# Altium project ADS1294.PrjPcb
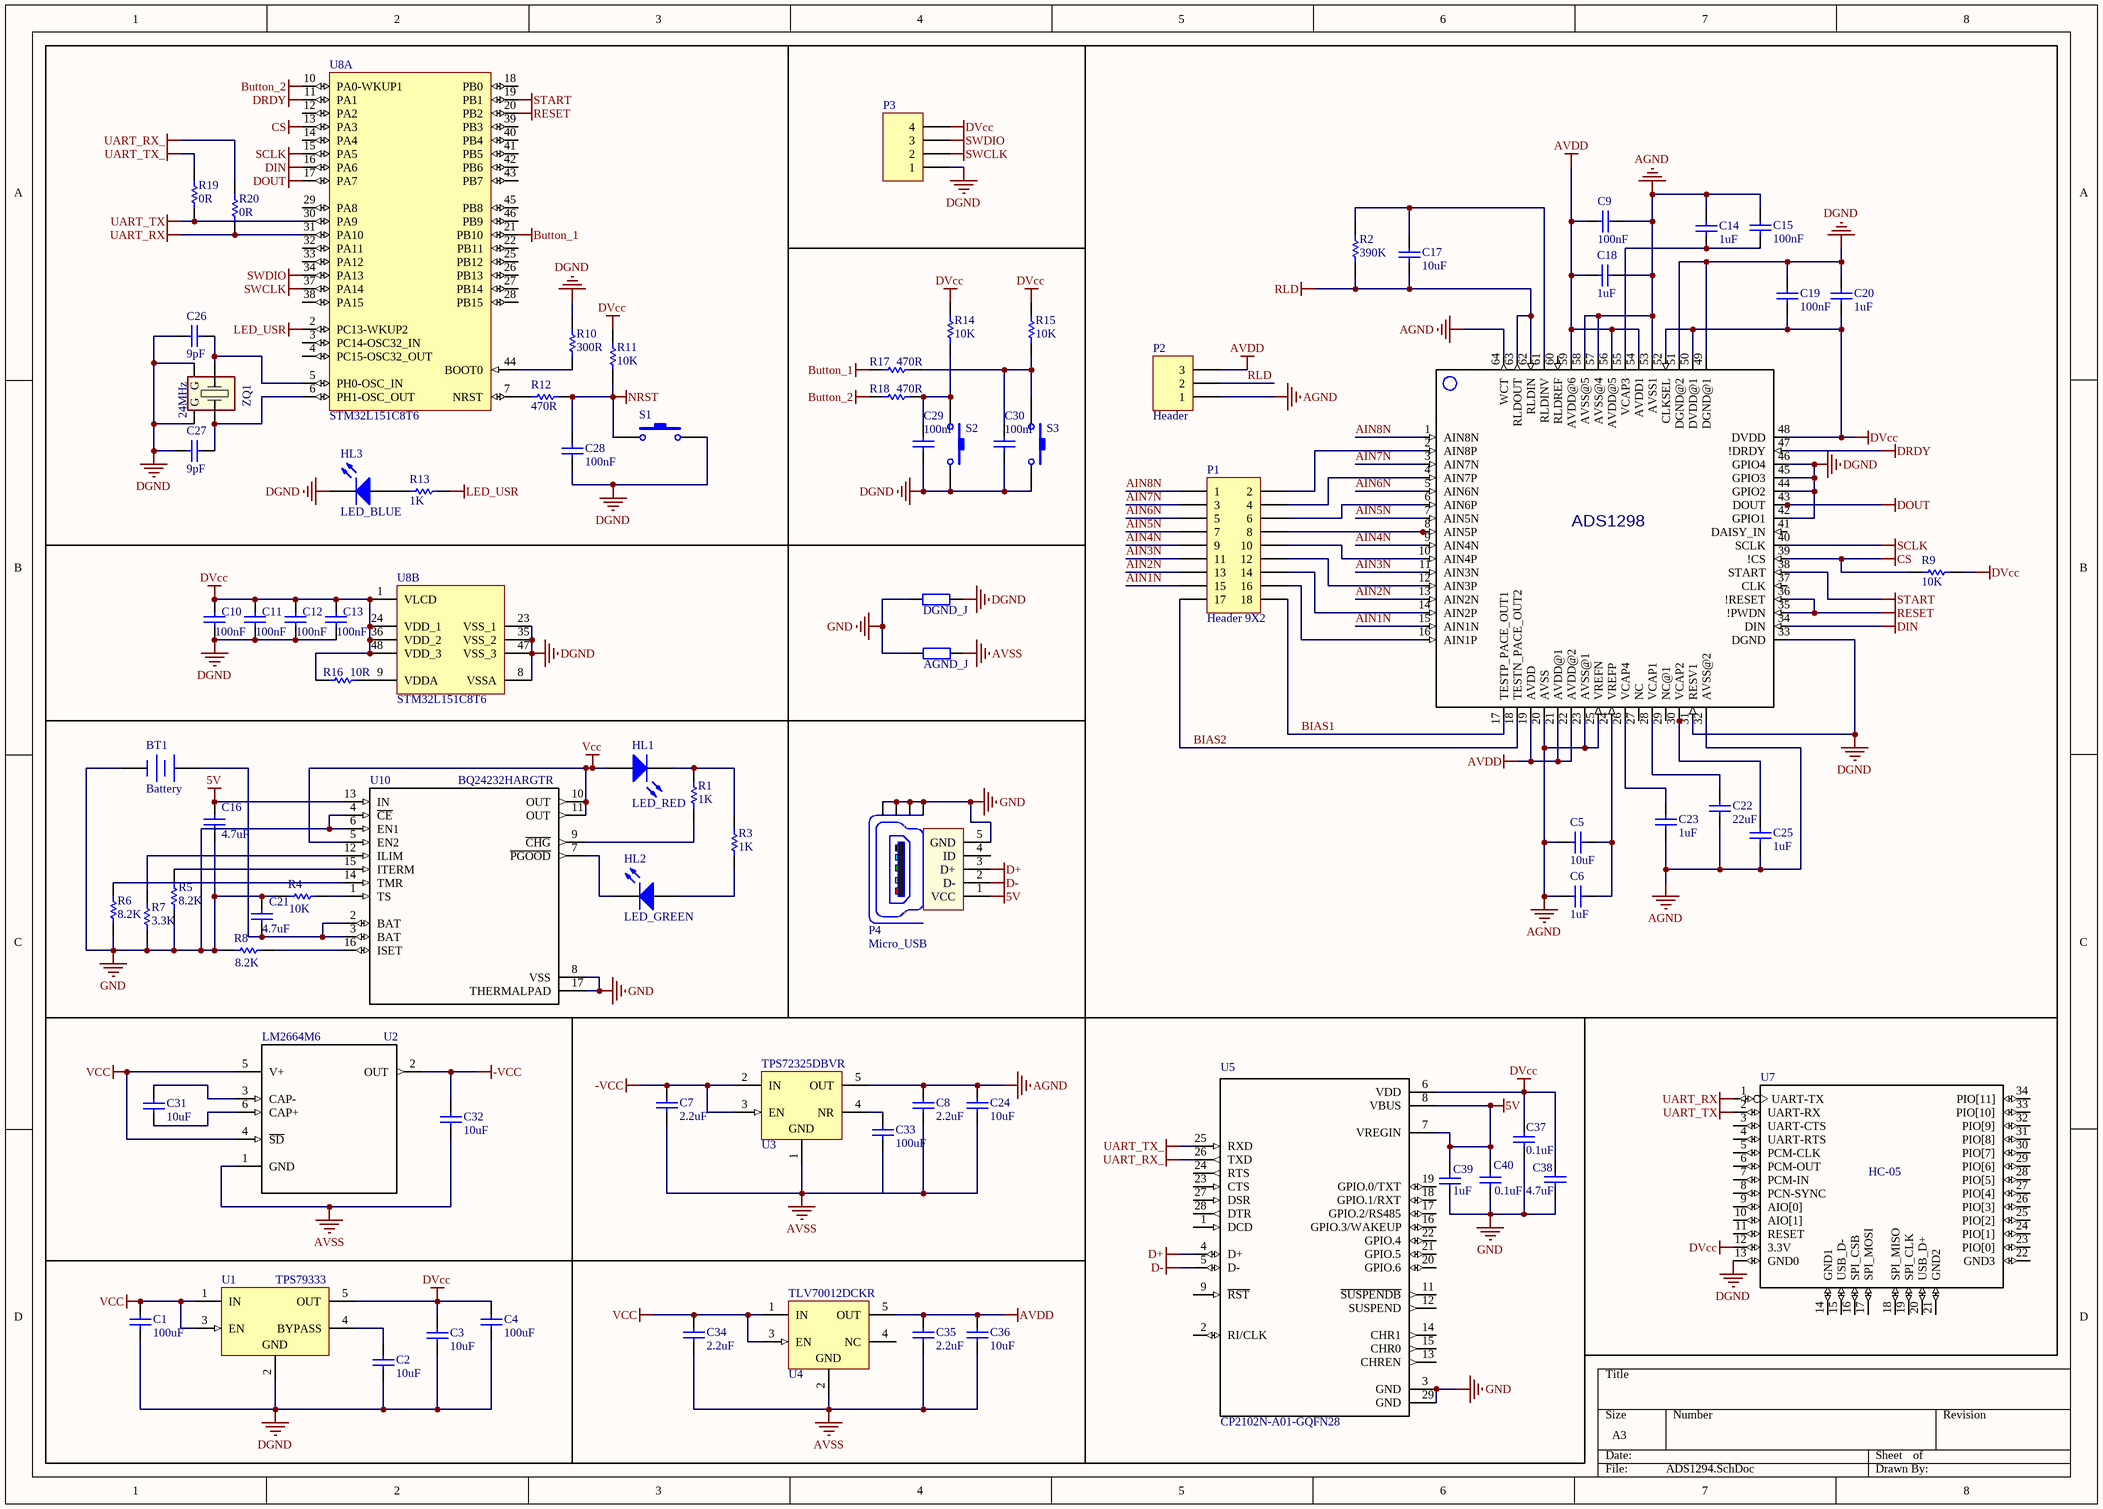
[diagram p0: ADS1294.SchDoc]
1 sheet, 83 parts. Net scope: global (net labels, ports and power ports of the same name join across sheets).
Board file: ADS1294.PcbDoc

## Sheet ADS1294.SchDoc
size A3

### Parts
AGND_J  Jumper 0805  [2012[0805] - Jumper - wa]  (value not drawn)  (net tie, no BOM)
BT1  Battery  [653002114822]
C1  value 100uF  [J1-0603]  (hidden comment: Cap Semi)
C2  value 10uF  [J1-0603]  (hidden comment: Cap Semi)
C3  value 10uF  [J1-0603]  (hidden comment: Cap Semi)
C4  value 100uF  [J1-0603]  (hidden comment: Cap Semi)
C5  value 10uF  [J1-0603]  (hidden comment: Cap Semi)
C6  value 1uF  [J1-0603]  (hidden comment: Cap Semi)
C7  value 2.2uF  [J1-0603]  (hidden comment: Cap Semi)
C8  value 2.2uF  [J1-0603]  (hidden comment: Cap Semi)
C9  value 100nF  [J1-0603]  (hidden comment: Cap Semi)
C10  value 100nF  [J1-0603]  (hidden comment: Cap Semi)
C11  value 100nF  [J1-0603]  (hidden comment: Cap Semi)
C12  value 100nF  [J1-0603]  (hidden comment: Cap Semi)
C13  value 100nF  [J1-0603]  (hidden comment: Cap Semi)
C14  value 1uF  [J1-0603]  (hidden comment: Cap Semi)
C15  value 100nF  [J1-0603]  (hidden comment: Cap Semi)
C16  value 4.7uF  [J1-0603]  (hidden comment: Cap Semi)
C17  value 10uF  [J1-0603]  (hidden comment: Cap Semi)
C18  value 1uF  [J1-0603]  (hidden comment: Cap Semi)
C19  value 100nF  [J1-0603]  (hidden comment: Cap Semi)
C20  value 1uF  [J1-0603]  (hidden comment: Cap Semi)
C21  value 4.7uF  [J1-0603]  (hidden comment: Cap Semi)
C22  value 22uF  [J1-0603]  (hidden comment: Cap Semi)
C23  value 1uF  [J1-0603]  (hidden comment: Cap Semi)
C24  value 10uF  [J1-0603]  (hidden comment: Cap Semi)
C25  value 1uF  [J1-0603]  (hidden comment: Cap Semi)
C26  value 9pF  [J1-0603]  (hidden comment: Cap Semi)
C27  value 9pF  [J1-0603]  (hidden comment: Cap Semi)
C28  value 100nF  [J1-0603]  (hidden comment: Cap Semi)
C29  value 100nF  [J1-0603]  (hidden comment: Cap Semi)
C30  value 100nF  [J1-0603]  (hidden comment: Cap Semi)
C31  value 10uF  [J1-0603]  (hidden comment: Cap Semi)
C32  value 10uF  [J1-0603]  (hidden comment: Cap Semi)
C33  value 100uF  [J1-0603]  (hidden comment: Cap Semi)
C34  value 2.2uF  [J1-0603]  (hidden comment: Cap Semi)
C35  value 2.2uF  [J1-0603]  (hidden comment: Cap Semi)
C36  value 10uF  [J1-0603]  (hidden comment: Cap Semi)
C37  value 0.1uF  [J1-0603]  (hidden comment: Cap Semi)
C38  value 4.7uF  [J1-0603]  (hidden comment: Cap Semi)
C39  value 1uF  [J1-0603]  (hidden comment: Cap Semi)
C40  value 0.1uF  [J1-0603]  (hidden comment: Cap Semi)
DGND_J  Jumper 0805  [2012[0805] - Jumper - wa]  (value not drawn)  (net tie, no BOM)
HL1  LED_RED  [1608[0603]]
HL2  LED_GREEN  [1608[0603]]
HL3  LED_BLUE  [1608[0603]]
IC1  ADS1298  [HTQFP-64-PAP]
P1  Header 9X2  [HDR2X9]
P2  Header  [653003114822]
P3  WE-1.25 mm Pitch 653004114822  [653004114822]  (value not drawn)
P4  Micro_USB  [Micro_USB]
R1  value 1K  [J1-0603]  (hidden comment: Res1)
R2  value 390K  [J1-0603]  (hidden comment: Res1)
R3  value 1K  [J1-0603]  (hidden comment: Res1)
R4  value 10K  [J1-0603]  (hidden comment: Res1)
R5  value 8.2K  [J1-0603]  (hidden comment: Res1)
R6  value 8.2K  [J1-0603]  (hidden comment: Res1)
R7  value 3.3K  [J1-0603]  (hidden comment: Res1)
R8  value 8.2K  [J1-0603]  (hidden comment: Res1)
R9  value 10K  [J1-0603]  (hidden comment: Res1)
R10  value 300R  [J1-0603]  (hidden comment: Res1)
R11  value 10K  [J1-0603]  (hidden comment: Res1)
R12  value 470R  [J1-0603]  (hidden comment: Res1)
R13  value 1K  [J1-0603]  (hidden comment: Res1)
R14  value 10K  [J1-0603]  (hidden comment: Res1)
R15  value 10K  [J1-0603]  (hidden comment: Res1)
R16  value 10R  [J1-0603]  (hidden comment: Res1)
R17  value 470R  [J1-0603]  (hidden comment: Res1)
R18  value 470R  [J1-0603]  (hidden comment: Res1)
R19  value 0R  [J1-0603]  (hidden comment: Res1)
R20  value 0R  [J1-0603]  (hidden comment: Res1)
S1  SW-PB  [KLS7-TS3606B]  (value not drawn)
S2  SW-PB  [KLS7-TS3606B]  (value not drawn)
S3  SW-PB  [KLS7-TS3606B]  (value not drawn)
U1  TPS79333  [TI-DBV5_N]
U2  LM2664M6  [*SOT95P300X120-6N]
U3  TPS72325DBVR  [TI-DBV5_N]
U4  TLV70012DCKR  [TI-DCK5_V]
U5  CP2102N-A01-GQFN28  [QFN50P500X500X80-29N]
U7  HC-05  [BT34P-SMD-1.5-26.9X13.0X2.2MM]
U8  STM32L151C8T6  [STM-LQFP48_N]  (parts A,B of 2)
U10  BQ24232HARGTR  [QFN50P300X300X100-17N]
ZQ1  24MHz  [CFPX-5]

### Nets
5V: C16.2 C39.1 C40.1 P4.1(VCC) U5.7(VREGIN) U5.8(VBUS) U10.13(IN)
-VCC: C7.1 C32.1 U2.2(OUT) U3.2(IN) U3.3(EN)
AGND: C5.2 C6.2 C8.2 C9.1 C14.1 C15.1 C18.1 C22.1 C23.1 C24.2 C25.1 IC1.20(AVSS) IC1.23(AVSS@1) IC1.25(VREFN) IC1.32(AVSS@2) IC1.53(AVSS1) IC1.57(AVSS@4) IC1.58(AVSS@5) IC1.64(WCT) P2.1 U3.5(OUT)
AVDD: C9.2 C18.2 C35.2 C36.2 IC1.19(AVDD) IC1.21(AVDD@1) IC1.22(AVDD@2) IC1.54(AVDD1) IC1.56(AVDD@5) IC1.59(AVDD@6) P2.3 U4.5(OUT)
AVSS: AGND_J.1 C7.2 C8.1 C24.1 C32.2 C34.1 C35.1 C36.1 U2.1(GND) U3.1(GND) U4.2(GND)
Button_1: R17.1 U8.21(PB10)
Button_2: R18.1 U8.10(PA0-WKUP1)
CS: IC1.39(!CS) R9.2 U8.13(PA3)
D+: P4.3(D+) U5.4(D+)
D-: P4.2(D-) U5.5(D-)
DGND: C1.1 C2.1 C3.1 C4.1 C10.1 C11.1 C12.1 C13.1 C19.2 C20.2 C26.2 C27.2 C28.2 C29.2 C30.2 DGND_J.1 HL3.2(K) IC1.31(RESV1) IC1.33(DGND) IC1.42(GPIO1) IC1.44(GPIO2) IC1.45(GPIO3) IC1.46(GPIO4) IC1.49(DGND@1) IC1.51(DGND@2) P3.1 R10.2 S1.2 S2.2 S3.2 U1.2(GND) U7.13(GND0) U8.8(VSSA) U8.23(VSS_1) U8.35(VSS_2) U8.47(VSS_3) ZQ1.2(G) ZQ1.4(G)
DIN: IC1.34(DIN) U8.16(PA6)
DOUT: IC1.43(DOUT) U8.17(PA7)
DRDY: IC1.47(!DRDY) U8.11(PA1)
DVcc: C3.2 C4.2 C10.2 C11.2 C12.2 C13.2 C19.1 C20.1 C37.1 C38.1 IC1.48(DVDD) IC1.50(DVDD@1) IC1.52(CLKSEL) P3.4 R9.1 R11.2 R14.2 R15.2 R16.1 U1.5(OUT) U5.6(VDD) U7.12(3.3V) U8.1(VLCD) U8.24(VDD_1) U8.36(VDD_2) U8.48(VDD_3)
GND: AGND_J.2 BT1.2(-) C16.1 C21.2 C37.2 C38.2 C39.2 DGND_J.2 P4.5(GND) P4.Z1(Shield) P4.Z2(Shield) P4.Z3(Shield) P4.Z4(Shield) R4.1 R5.1 R6.1 R7.1 R8.1 U5.3(GND) U5.29(GND) U10.4(~{CE}) U10.6(EN1) U10.8(VSS) U10.17(THERMALPAD)
LED_USR: R13.2 U8.2(PC13-WKUP2)
NRST: C28.1 R11.1 R12.2 S1.1
RESET: IC1.35(!PWDN) IC1.36(!RESET) U8.20(PB2)
RLD: C17.2 IC1.62(RLDIN) IC1.63(RLDOUT) P2.2 R2.1
SCLK: IC1.40(SCLK) U8.15(PA5)
START: IC1.38(START) U8.19(PB1)
SWCLK: P3.2 U8.37(PA14)
SWDIO: P3.3 U8.34(PA13)
UART_RX: R20.2 U7.1(UART-TX) U8.31(PA10)
UART_RX_: R20.1 U5.26(TXD)
UART_TX: R19.2 U7.2(UART-RX) U8.30(PA9)
UART_TX_: R19.1 U5.25(RXD)
VCC: C1.2 C34.2 HL1.1(A) U1.1(IN) U1.3(EN) U2.4(~{SD}) U2.5(V+) U4.1(IN) U4.3(EN) U10.5(EN2) U10.10(OUT) U10.11(OUT)
AIN1N: IC1.15(AIN1N) P1.15
AIN2N: IC1.13(AIN2N) P1.13
AIN3N: IC1.11(AIN3N) P1.11
AIN4N: IC1.9(AIN4N) P1.9
AIN5N: IC1.7(AIN5N) P1.7
AIN6N: IC1.5(AIN6N) P1.5
AIN7N: IC1.3(AIN7N) P1.3
AIN8N: IC1.1(AIN8N) P1.1
BIAS1: IC1.17(TESTP_PACE_OUT1) P1.18
BIAS2: IC1.18(TESTN_PACE_OUT2) P1.17
NetBT1_1: BT1.1(+) C21.1 U10.2(BAT) U10.3(BAT)
NetC2_2: C2.2 U1.4(BYPASS)
NetC5_1: C5.1 C6.1 IC1.24(VREFP)
NetC14_2: C14.2 C15.2 IC1.55(VCAP3)
NetC17_1: C17.1 IC1.61(RLDINV) R2.2
NetC22_2: C22.2 IC1.28(VCAP1)
NetC23_2: C23.2 IC1.26(VCAP4)
NetC25_2: C25.2 IC1.30(VCAP2)
NetC26_1: C26.1 U8.5(PH0-OSC_IN) ZQ1.1
NetC27_1: C27.1 U8.6(PH1-OSC_OUT) ZQ1.3
NetC29_1: C29.1 R14.1 R18.2 S2.1
NetC30_1: C30.1 R15.1 R17.2 S3.1
NetC31_1: C31.1 U2.6(CAP+)
NetC31_2: C31.2 U2.3(CAP-)
NetC33_2: C33.2 U3.4(NR)
NetHL1_2: HL1.2(K) R1.1 R3.1
NetHL2_1: HL2.1(A) R3.2
NetHL2_2: HL2.2(K) U10.7(~{PGOOD})
NetHL3_1: HL3.1(A) R13.1
NetIC1_2: IC1.2(AIN8P) P1.2
NetIC1_4: IC1.4(AIN7P) P1.4
NetIC1_6: IC1.6(AIN6P) P1.6
NetIC1_8: IC1.8(AIN5P) P1.8
NetIC1_10: IC1.10(AIN4P) P1.10
NetIC1_12: IC1.12(AIN3P) P1.12
NetIC1_14: IC1.14(AIN2P) P1.14
NetIC1_16: IC1.16(AIN1P) P1.16
NetR1_2: R1.2 U10.9(~{CHG})
NetR4_2: R4.2 U10.1(TS)
NetR5_2: R5.2 U10.15(ITERM)
NetR6_2: R6.2 U10.14(TMR)
NetR7_2: R7.2 U10.12(ILIM)
NetR8_2: R8.2 U10.16(ISET)
NetR10_1: R10.1 U8.44(BOOT0)
NetR12_1: R12.1 U8.7(NRST)
NetR16_2: R16.2 U8.9(VDDA)

Not connected (* = marked no-connect by the designer): C33 1; C40 2; IC1 27(NC) 29(NC@1) 37(CLK) 41(DAISY_IN) 60(RLDREF); P4 4(ID); U4 4(NC); U5 1(DCD) 2(RI/CLK) 9(~{RST}) 11(~{SUSPENDB}) 12(SUSPEND) 13(CHREN) 14(CHR1) 15(CHR0) 16(GPIO.3/WAKEUP) 17(GPIO.2/RS485) 18(GPIO.1/RXT) 19(GPIO.0/TXT) 20(GPIO.6) 21(GPIO.5) 22(GPIO.4) 23(CTS) 24(RTS) 27(DSR) 28(DTR); U7 3(UART-CTS) 4(UART-RTS) 5(PCM-CLK) 6(PCM-OUT) 7(PCM-IN) 8(PCN-SYNC) 9(AIO[0]) 10(AIO[1]) 11(RESET) 14(GND1) 15(USB_D-) 16(SPI_CSB) 17(SPI_MOSI) 18(SPI_MISO) 19(SPI_CLK) 20(USB_D+) 21(GND2) 22(GND3) 23(PIO[0]) 24(PIO[1]) 25(PIO[2]) 26(PIO[3]) 27(PIO[4]) 28(PIO[5]) 29(PIO[6]) 30(PIO[7]) 31(PIO[8]) 32(PIO[9]) 33(PIO[10]) 34(PIO[11]); U8 3(PC14-OSC32_IN) 4(PC15-OSC32_OUT) 12(PA2) 14(PA4) 18(PB0) 22(PB11) 25(PB12) 26(PB13) 27(PB14) 28(PB15) 29(PA8) 32(PA11) 33(PA12) 38(PA15) 39(PB3) 40(PB4) 41(PB5) 42(PB6) 43(PB7) 45(PB8) 46(PB9)

### Library data of the parts
AGND_J DGND_J = Jumper 0805: Перемычка; Value: 0; Product: Сергеев Е. М.
BT1 = Battery: Multicell Battery; Published: 24-Mar-1999; LatestRevisionDate: 17-Jul-2002; LatestRevisionNote: Re-released for DXP Platform.; PackageReference: BAT-2; Publisher: Altium Limited; PackageDescription: Battery; 2 Leads
C1-C40 = Cap Semi: Capacitor (Semiconductor SIM Model); PackageReference: C1206
  C1-C9 C14 C15 C17-C20 C22-C25 C31-C40: Published: 17-Mar-2010; Publisher: Sergeev
  C10-C13 C16 C21 C26-C30: Published: 8-Jun-2000; LatestRevisionDate: 29-May-2009; LatestRevisionNote: IPC-7351 Footprint Added.; Publisher: Altium Limited; PackageDescription: Chip Capacitor
HL1-HL3 = LED SMD: Typical INFRARED GaAs LED; Published: 4-Feb-2010; PackageReference: SMD 1206; Publisher: Сергеев; магазин: http://chip-nn.ru/67.php; Datasheet: http://chip-nn.ru/doc/led/s1206ygsc/s1206ygsc.zip
IC1 = ADS1298: 8-Channel 24-Bit Analog-To-Digital Converter With Integrated ECG Front End; MF: Texas Instruments; MP: ADS1298; Price: None; Package: None; Availability: Unavailable; Value: *
P1 = Header 9X2: Header, 9-Pin, Dual row; LatestRevisionDate: 17-Jul-2002; LatestRevisionNote: Re-released for DXP Platform.; Publisher: Altium Limited
P2 = WE-1.25 mm Pitch 653003114822: WR-WTB 1.25mm; Manufacturer: WЁ№rth Elektronik eiSos GmbH; ComponentLink1 Description: Manufacturer; ComponentLink2 Description: Datasheet; NoPins: 3; Created Date: 17 June 2013; partNo: 653003114822; ComponentLink1URL: http://www.we-online.com; ComponentLink2URL: http://katalog.we-online.de/em/datasheet/6530xx114822.pdf; Created by: Karrer Zheng
P3 = WE-1.25 mm Pitch 653004114822: WR-WTB 1.25mm; Manufacturer: WЁ№rth Elektronik eiSos GmbH; ComponentLink1 Description: Manufacturer; ComponentLink2 Description: Datasheet; NoPins: 4; Created Date: 17 June 2013; partNo: 653004114822; ComponentLink1URL: http://www.we-online.com; ComponentLink2URL: http://katalog.we-online.de/em/datasheet/6530xx114822.pdf; Created by: Karrer Zheng
P4 = WE-Communication Connectors 629105136821: WR-COM Micro USB SMT Type B; Manufacturer: Würth Elektronik eiSos GmbH; ComponentLink1 Description: Manufacturer; ComponentLink2 Description: Datasheet; NoPins: 5; ComponentLink1URL: http://www.we-online.de; ComponentLink2URL: http://katalog.we-online.de/em/datasheet/629105136821.pdf; Created by: Karrer Zheng; Created Date: 10/10/2014; partNo: 629105136821
R1-R20 = Res1: Resistor; Published: 8-Jun-2000; LatestRevisionDate: 17-Jul-2002; LatestRevisionNote: Re-released for DXP Platform.; PackageReference: AXIAL-0.3; Publisher: Altium Limited; PackageDescription: Axial Device, Thru-Hole; 2 Leads; 0.3 in Pin Spacing
S1-S3 = SW-PB: Switch; Published: 24-Mar-1999; LatestRevisionDate: 17-Jul-2002; LatestRevisionNote: Re-released for DXP Platform.; PackageReference: SPST-2; Publisher: Altium Limited; PackageDescription: Switch; 2 Leads
U1 = TPS79333DBVREP: Single Output Fast RF LDO, 200 mA, Fixed 3.3 V Output, 2.7 to 5.5 V Input, 5-pin SOT-23 (DBV), -40 to 125 degC, Green (RoHS & no Sb/Br); Manufacturer: Texas Instruments; Accuracy(%): 2; Fixed Output Options(V): 3.3; Iout(Max)(A): 0.2; Rating: HiRel Enhanced Product; SubFamily: Single Channel LDO; Vdo(Typ)(mV): 102; Vin(Max)(V): 5.5; Vin(Min)(V): 2.7; DatasheetVersion: SGLS163B; PackageVersion: 4073253-4/K; PackageReference: DBV5; PackageDescription: 5-Pin Plastic Small Outline, Body 1.60 Г— 2.90 mm, Pitch 0.95 mm; Supplier 1: Digi-Key; Supplier Part Number 1: 296-18172-2-ND; Supplier 2: Digi-Key; Supplier Part Number 2: 296-18172-1-ND; Supplier 3: Digi-Key; Supplier Part Number 3: 296-18172-6-ND; Supplier 4: Newark; Supplier Part Number 4: 46M1206; Supplier 5: Mouser; Supplier Part Number 5: 595-TPS79333DBVREP; Eco-Plan: Green (RoHS & no Sb/Br); Iq(Typ)(mA): 0.2; Vout Adj(Max)(V): 3.3; Vout Adj(Min)(V): 3.3; Mounting Technology: Surface Mount; Code_JEDEC: MO-178; PartNumber: TPS79333DBVREP; ComponentLink1Description: Manufacturer URL; ComponentLink1URL: http://www.ti.com/; ComponentLink2Description: Datasheet; ComponentLink2URL: http://www.ti.com/general/docs/lit/getliterature.tsp?genericPartNumber=TPS79333-EP&fileType=pdf; ComponentLink3Description: Package Specification; ComponentLink3URL: http://www.ti.com/litv/pdf/mpds018i
U2 = LM2664M6: Switched Capacitor Voltage Converter 6-SOT-23 -40 to 85; MF: Texas Instruments; MP: LM2664M6/NOPB; Package: SOT-23-6 Texas Instruments; Digi-Key_Purchase_URL: https://www.digikey.com.ua/product-detail/en/texas-instruments/LM2664M6-NOPB/LM2664M6-NOPBCT-ND/363758?utm_source=snapeda&utm_medium=aggregator&utm_campaign=symbol; SnapEDA_Link: https://www.snapeda.com/parts/LM2664M6/NOPB/Texas%20Instruments/view-part/?ref=snap; Digi-Key_Part_Number: LM2664M6/NOPBCT-ND; Value: *
U3 = TPS72325DBVR: Single Output High PSRR LDO, 200 mA, Fixed -2.5 V Output, -10 to -2.7 V Input, 5-pin SOT-23 (DBV), -40 to 125 degC, Green (RoHS & no Sb/Br); Manufacturer: Texas Instruments; Accuracy(%): 2; Iout(Max)(A): 0.2; Iq(Typ)(mA): 0.13; SubFamily: Single Channel LDO; Vdo(Typ)(mV): 280; DatasheetVersion: SLVS346B; PackageVersion: 4073253-4/K; PackageReference: DBV5; PackageDescription: 5-Pin Plastic Small Outline, Body 1.60 Г— 2.90 mm, Pitch 0.95 mm; Supplier 1: Digi-Key; Supplier Part Number 1: TPS72325DBVR-ND; Supplier 2: Newark; Supplier Part Number 2: 87H2932; Supplier 3: Mouser; Supplier Part Number 3: 595-TPS72325DBVR; Eco-Plan: Green (RoHS & no Sb/Br); Fixed Output Options(V): -2.5; Vin(Max)(V): -2.7; Vin(Min)(V): -10; Vout Adj(Max)(V): -2.5; Vout Adj(Min)(V): -2.5; Mounting Technology: Surface Mount; Code_JEDEC: MO-178; PartNumber: TPS72325DBVR; ComponentLink1Description: Manufacturer URL; ComponentLink1URL: http://www.ti.com/; ComponentLink2Description: Datasheet; ComponentLink2URL: http://www.ti.com/general/docs/lit/getliterature.tsp?genericPartNumber=TPS72325&fileType=pdf; ComponentLink3Description: Package Specification; ComponentLink3URL: http://www.ti.com/litv/pdf/mpds018i
U4 = TLV70012DCKR: Single Output LDO, 200 mA, Fixed 1.2 V Output, 2 to 5.5 V Input, with Low IQ, 5-pin SC70 (DCK), -40 to 125 degC, Green (RoHS & no Sb/Br); Manufacturer: Texas Instruments; Accuracy(%): 2; Fixed Output Options(V): 1.2; Iout(Max)(A): 0.2; Iq(Typ)(mA): 0.03; SubFamily: Single Channel LDO; Vdo(Typ)(mV): 175; Vin(Max)(V): 5.5; DatasheetVersion: SLVSA00D; PackageVersion: 4093553-3/G; PackageReference: DCK5; PackageDescription: 5-Pin Plastic Small-Outline, Body 2 x 1.25 mm, Pitch 0.65 mm; Supplier 1: Digi-Key; Supplier Part Number 1: 296-27438-2-ND; Supplier 2: Digi-Key; Supplier Part Number 2: 296-27438-1-ND; Supplier 3: Digi-Key; Supplier Part Number 3: 296-27438-6-ND; Supplier 4: Newark; Supplier Part Number 4: 79R8518; Supplier 5: Mouser; Supplier Part Number 5: 595-TLV70012DCKR; Eco-Plan: Green (RoHS & no Sb/Br); Vin(Min)(V): 2; Vout Adj(Max)(V): 1.2; Vout Adj(Min)(V): 1.2; Mounting Technology: Surface Mount; Code_JEDEC: MO-203; PartNumber: TLV70012DCKR; ComponentLink1Description: Manufacturer URL; ComponentLink1URL: http://www.ti.com/; ComponentLink2Description: Datasheet; ComponentLink2URL: http://www.ti.com/general/docs/lit/getliterature.tsp?genericPartNumber=TLV70012&fileType=pdf; ComponentLink3Description: Package Specification; ComponentLink3URL: http://www.ti.com/litv/pdf/mpds025f
U5 = CP2102N-A01-GQFN28: Usb-Uart Interface Bridge, Qfn-28; MF: Silicon Labs; Availability: Unavailable; Package: QFN-28 Silicon Labs; Price: None; SnapEDA_Link: https://www.snapeda.com/parts/CP2102N-A01-GQFN28/Silicon%20Labs/view-part/?ref=snap; MP: CP2102N-A01-GQFN28; Value: *
U7 = MOUDLE-BLUETOOTH-HC-05(34P-27X13MM): Semiconductors and Actives, pin, soic; MP: HC05; MF: Texas Instruments; Package: None; Availability: Unavailable; Price: None; Value: *
U8 = STM32L151C8T6: ARM Cortex-M3 32-bit MCU, 64 KB Flash, 10 KB Internal RAM, 37 I/Os, 48-pin LQFP, -40 to 85 degC, Tray; Manufacturer: STMicroelectronics; D/A Converter: 2x12-bit (2 Channel); Data E2PROM nom (B): 4096; FLASH Size (Prog) (kB): 64; I/Os (High Current): 37; Internal RAM Size (kB): 10; Operating Frequency(F) (Processor speed) (MHz): 32; Supply Voltage(Vcc) min (V): 1.65; DatasheetVersion: Rev. 8; PackageVersion: Rev. 6, 06/2013; PackageReference: LQFP48; PackageDescription: 48-Pin Low Profile Quad Flat Package, 7 x 7 mm Body, 0.5 mm Pitch; Core: ARM Cortex-M3; Packing: Tray; Mounting Technology: Surface Mount; PartNumber: STM32L151C8T6; ComponentLink1Description: Manufacturer URL; ComponentLink1URL: http://www.st.com/web/en/home.html; ComponentLink2Description: Datasheet; ComponentLink2URL: http://www.st.com/st-web-ui/static/active/en/resource/technical/document/datasheet/CD00277537.pdf; ComponentLink3Description: Package Specification; ComponentLink3URL: http://www.st.com/st-web-ui/static/active/en/resource/technical/document/datasheet/DM00058181.pdf
U10 = BQ24232HARGTR: USB-Friendly Lithium-Ion Battery Charger and Power-Path Management IC 0.5A 10.5V OVP 16-Pin QFN T/R; MF: Texas Instruments; Package: VFQFN-16 Texas Instruments; Availability: Unavailable; MP: BQ24232HARGTR; SnapEDA_Link: https://www.snapeda.com/parts/BQ24232HARGTR/Texas%2520Instruments/view-part/?ref=snap; Price: None; Value: *
ZQ1 = QUARTZ - KX7: Quartz smd - case KX - 7 Geyer; Value: 24MHz